# Altium schematic sheet motordriver-v5.0_connectors.SchDoc
size A4; SheetNumber: 8; SheetTotal: 10
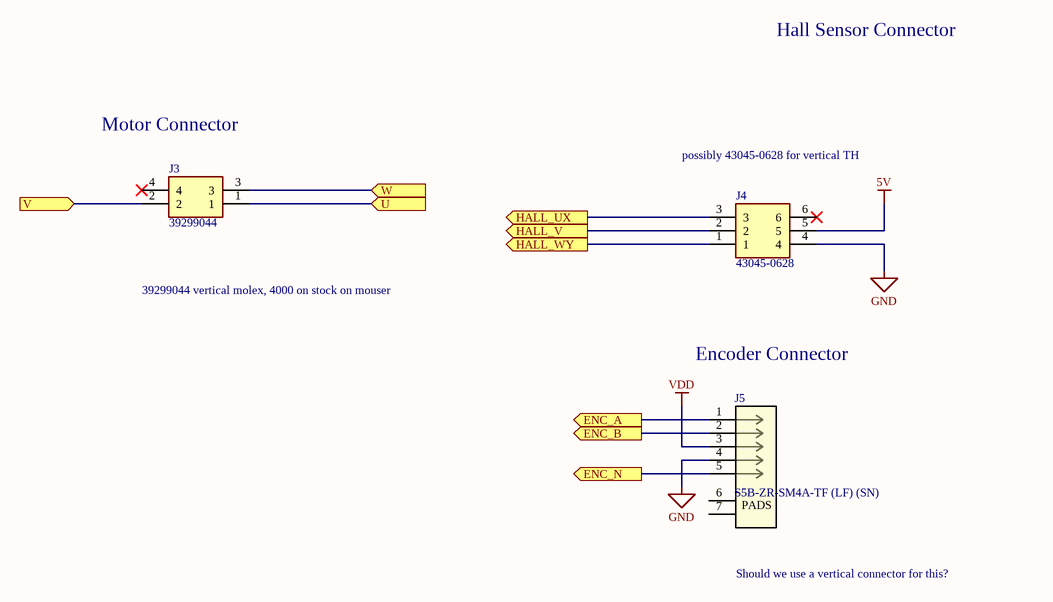
[diagram p0: motordriver-v5.0_connectors.SchDoc]

## Parts
J3  39299044  [39299044]
J4  43045-0628  [430450628]
J5  S5B-ZR-SM4A-TF (LF) (SN)  [JST_S5B-ZR-SM4A-TF]

## Ports
ENC_A (out), ENC_B (out), ENC_N (out), HALL_UX (out), HALL_V (out), HALL_WY (out), U (in), V (in), W (in)

## Nets
5V: J4.5
GND: J4.4 J5.4
VDD: J5.3
ENC_A: J5.1 ; port ENC_A
ENC_B: J5.2 ; port ENC_B
ENC_N: J5.5 ; port ENC_N
HALL_UX: J4.3 ; port HALL_UX
HALL_V: J4.2 ; port HALL_V
HALL_WY: J4.1 ; port HALL_WY
U: J3.1 ; port U
V: J3.2 ; port V
W: J3.3 ; port W

Not connected (* = marked no-connect by the designer): J3 4*; J4 6*; J5 6 7

## Notes on the sheet
- Hall Sensor Connector
- Motor Connector
- possibly 43045-0628 for vertical TH
- 39299044 vertical molex, 4000 on stock on mouser
- Encoder Connector
- Should we use a vertical connector for this?
- (in symbol CN 5POS JST ZR RA) PADS

## Library data of the parts
J3 = CN HDR 4POS Molex 39299044 VERT: Molex 39299044 4POS Minifit / dual row, vertical; Supplier 1: Digi-Key; Supplier Part Number 1: WM7336-ND; Part Number: CN HDR 4POS Molex 39299044 VERT; Manufacturer Part Number: 39299044; Supplier URL 1: https://www.digikey.ca/en/products/detail/molex/0039299044/1624292?s=N4IgTCBcDaIOoFkDsBmFA2AtAOQCIgF0BfIA; Pin Count: 4
J4 = CN HDR 6POS Molex 43045-0628: Molex 43045-0628 6POS Microfit / dual row, Vertical; Supplier 1: Digi-Key; Supplier Part Number 1: WM10679-ND; Part Number: CN HDR 6POS Molex 43045-0628; Manufacturer Part Number: 430450628; Supplier URL 1: https://www.digikey.ca/en/products/detail/molex/0430450628/3310200?s=N4IgTCBcDaICwGYAMcCsSBsYAcAdXIAugL5A; Pin Count: 6
J5 = CN 5POS JST ZR RA: Connector Header Surface Mount, Right Angle 5 position 0.059" (1.50mm); Supplier 1: Digi-Key; Supplier Part Number 1: 455-1696-1-ND; Part Number: CN 5POS JST ZR RA; Manufacturer Part Number: S5B-ZR-SM4A-TF; Supplier URL 1: https://www.digikey.ca/en/products/detail/jst-sales-america-inc/S5B-ZR-SM4A-TF-LF-SN/926603?s=N4IgTCBcDaICwFYEFoCMA2AnOtyByAIiALoC%2BQA; Pin Count: 5